# Altium schematic sheet POWER&USB_UART.SchDoc: 电源模块
size A4; Revision: V1.0
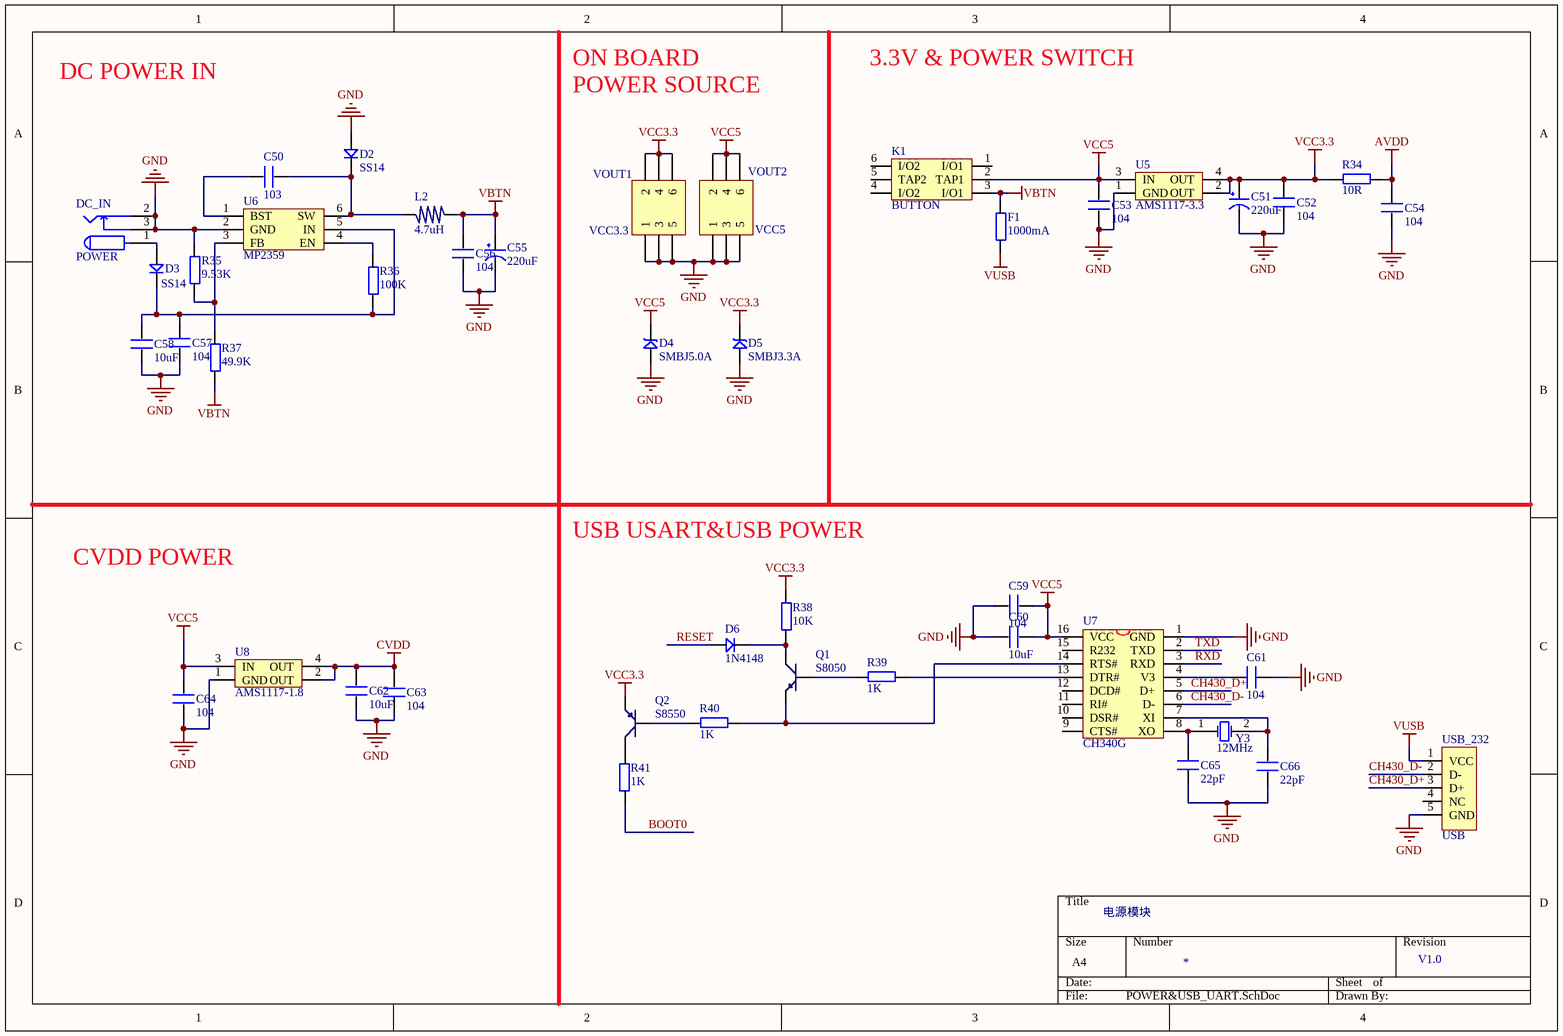
[diagram p0: POWER&USB_UART.SchDoc]

## Parts
C50  103  [0603P]
C51  220uF  [CC6.56.5]
C52  104  [0603P]
C53  104  [0603P]
C54  104  [0603P]
C55  220uF  [CC6.56.5]
C56  104  [0603P]
C57  104  [0603P]
C58  10uF  [0603P]
C59  104  [0603P]
C60  10uF  [0603P]
C61  104  [0603P]
C62  10uF  [0603P]
C63  104  [0603P]
C64  104  [0603P]
C65  22pF  [0603P]
C66  22pF  [0603P]
D2  SS14  [DIODE_3*5.3]
D3  SS14  [DIODE_3*5.3]
D4  SMBJ5.0A  [SMBJ]
D5  SMBJ3.3A  [SMBJ]
D6  1N4148  [DIODE_SOP]
DC_IN  POWER  [DC10B]
F1  1000mA  [1206]
K1  BUTTON  [BTN8.5*8.5]
L2  4.7uH  [L_SOP74]
Q1  S8050  [SOT-23R]
Q2  S8550  [SOT-23R]
R34  10R  [0603P]
R35  9.53K  [0603P]
R36  100K  [0603P]
R37  49.9K  [0603P]
R38  10K  [0603P]
R39  1K  [0603P]
R40  1K  [0603P]
R41  1K  [0603P]
U5  AMS1117-3.3  [AMS1117]
U6  MP2359  [SOT-23-6]
U7  CH340G  [SOP16M]
U8  AMS1117-1.8  [AMS1117]
USB_232  USB  [USB/SM0.8-6H5]
VOUT1  VCC3.3  [HDR2X3]
VOUT2  VCC5  [HDR2X3]
Y3  12MHz  [XTAL_US]

## Nets
AVDD: C54.2 R34.1
CVDD: C62.2 C63.2 U8.2(OUT) U8.4(OUT)
GND: C51.2(GND) C52.1 C53.1 C54.1 C55.2(GND) C56.1 C57.1 C58.1 C59.2 C60.2 C61.1 C62.1 C63.1 C64.1 C65.2 C66.2 D2.1 D4.1 D5.1 DC_IN.2 DC_IN.3 R35.2 U5.1(GND) U6.2(GND) U7.1(GND) U8.1(GND) USB_232.5(GND) VOUT1.1 VOUT1.3 VOUT1.5 VOUT2.1 VOUT2.3 VOUT2.5
VBTN: C55.1(VCC) C56.2 F1.2 K1.3(I/O1) L2.2 R37.1
VCC3.3: C51.1(VCC) C52.2 D5.2 Q2.1(E) R34.2 R38.2 U5.2(OUT) U5.4(OUT) VOUT1.2 VOUT1.4 VOUT1.6
VCC5: C53.2 C59.1 C60.1 C64.2 D4.2 K1.2(TAP1) U5.3(IN) U7.16(VCC) U8.3(IN) VOUT2.2 VOUT2.4 VOUT2.6
VUSB: F1.1 USB_232.1(VCC)
BOOT0: R41.2
CH430_D+: U7.5(D+) USB_232.3(D+)
CH430_D-: U7.6(D-) USB_232.2(D-)
RESET: D6.1
RXD: U7.3(RXD)
TXD: U7.2(TXD)
NetC50_1: C50.1 U6.1(BST)
NetC50_2: C50.2 D2.2 L2.1 U6.6(SW)
NetC57_2: C57.2 C58.2 D3.2 R36.1 U6.5(IN)
NetC61_2: C61.2 U7.4(V3)
NetC65_1: C65.1 U7.8(XO) Y3.1(OSC1)
NetC66_1: C66.1 U7.7(XI) Y3.2(OSC2)
NetD3_1: D3.1 DC_IN.1
NetD6_2: D6.2 Q1.3(C) R38.1
NetQ1_1: Q1.1(E) R40.1 U7.14(RTS#)
NetQ1_2: Q1.2(B) R39.2
NetQ2_2: Q2.2(B) R40.2
NetQ2_3: Q2.3(C) R41.1
NetR35_1: R35.1 R37.2 U6.3(FB)
NetR36_2: R36.2 U6.4(EN)
NetR39_1: R39.1 U7.13(DTR#)

Not connected (* = marked no-connect by the designer): K1 1(I/O1) 4(I/O2) 5(TAP2) 6(I/O2); U7 9(CTS#) 10(DSR#) 11(RI#) 12(DCD#) 15(R232); USB_232 4(NC)

## Notes on the sheet
- DC POWER IN
- ON BOARD
- POWER SOURCE
- 3.3V & POWER SWITCH
- CVDD POWER
- USB USART&USB POWER

## Library data of the parts
C50 C52-C54 C56-C66 = C
C51 C55 = CAP
D2 D3 D6 = D
D4 D5 = SMBJ: TVS
DC_IN = POW
F1 R34-R41 = R
L2 = L
Q1 = NPN: 8050/BCW846/BCW847
Q2 = PNP: 8550/BCW68
U5 U8 = AMS1117
U6 = MP2359: DC DC Step Down IC
U7 = CH340G: USB2UART
USB_232 = USB5
VOUT1 VOUT2 = Header 3X2: Header, 3-Pin, Dual row; LatestRevisionDate: 17-Jul-2002; LatestRevisionNote: Re-released for DXP Platform.; Publisher: Altium Limited
Y3 = XTAL: Crystal Oscillator; Published: 8-Jun-2000; LatestRevisionDate: 17-Jul-2002; LatestRevisionNote: Re-released for DXP Platform.; Publisher: Altium Limited